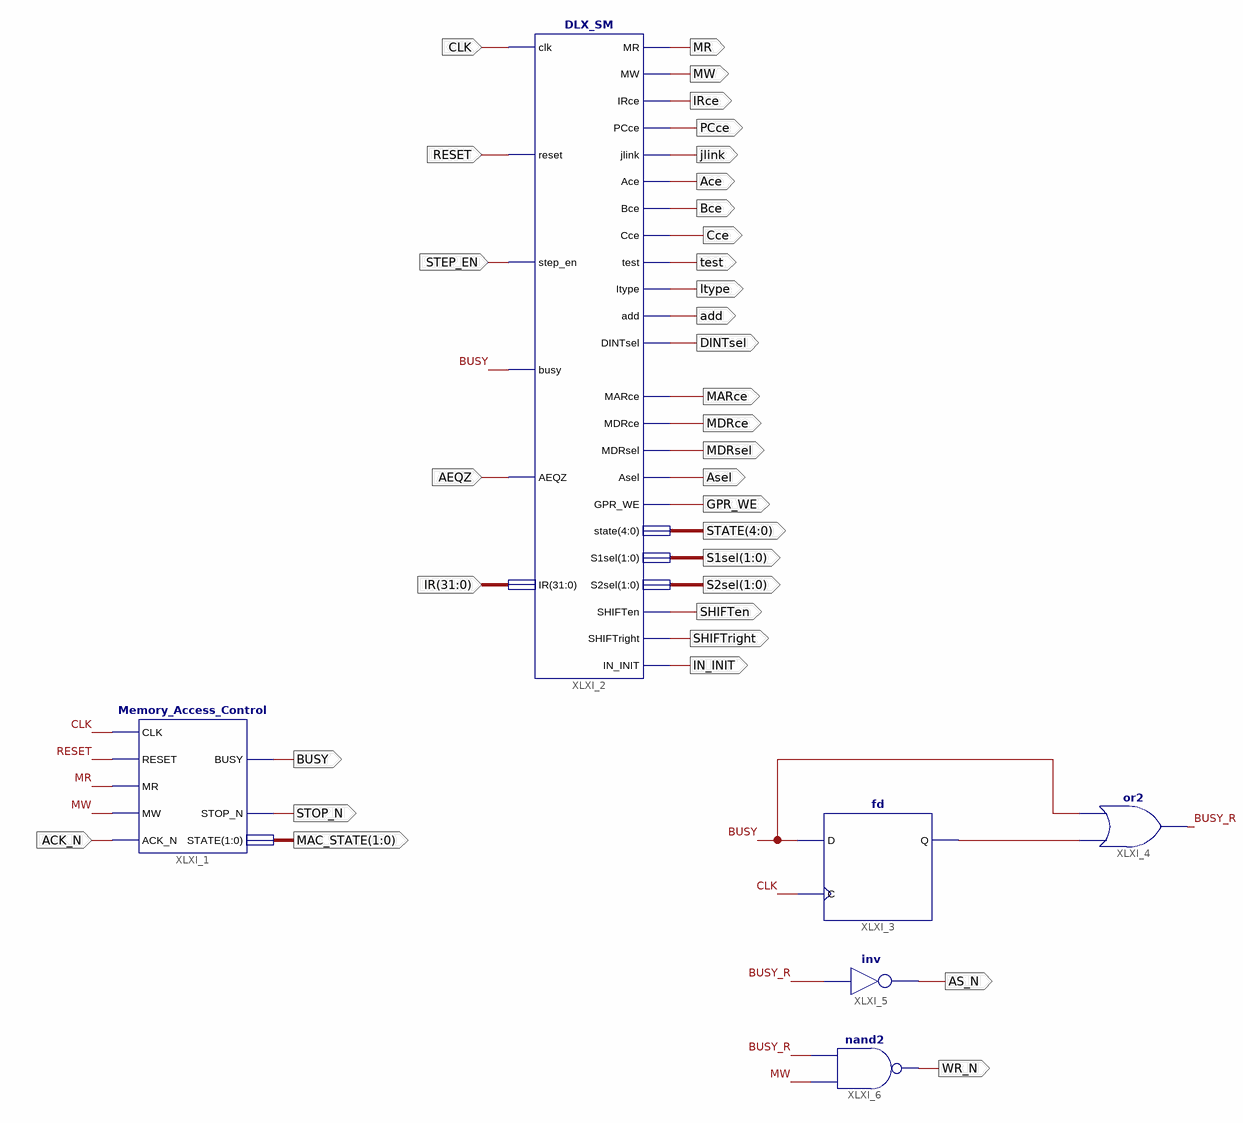
[diagram p0: schematic sheet 1]
// Xilinx ISE schematic DLX_Control.sch (spartan6) as structural Verilog: 6 symbols, 34 ports
module DLX_Control (
  input  ACK_N,
  input  CLK,
  input  RESET,
  input  STEP_EN,
  input  AEQZ,
  input  [31:0] IR,
  output STOP_N,
  output [1:0] MAC_STATE,
  output BUSY,
  output MR,
  output MW,
  output IRce,
  output PCce,
  output jlink,
  output Ace,
  output Bce,
  output Cce,
  output test,
  output Itype,
  output add,
  output DINTsel,
  output MARce,
  output MDRce,
  output MDRsel,
  output Asel,
  output GPR_WE,
  output [4:0] STATE,
  output [1:0] S1sel,
  output [1:0] S2sel,
  output SHIFTen,
  output SHIFTright,
  output AS_N,
  output WR_N,
  output IN_INIT
);

  wire BUSY_R, XLXN_41;

  Memory_Access_Control XLXI_1 (
    .CLK(CLK), .RESET(RESET), .MR(MR), .MW(MW), .ACK_N(ACK_N), .BUSY(BUSY), .STOP_N(STOP_N), .STATE(MAC_STATE));
  DLX_SM XLXI_2 (
    .clk(CLK), .reset(RESET), .step_en(STEP_EN), .busy(BUSY), .AEQZ(AEQZ), .IR(IR), .MR(MR), .MW(MW),
    .IRce(IRce), .PCce(PCce), .jlink(jlink), .Ace(Ace), .Bce(Bce), .Cce(Cce), .test(test), .Itype(Itype),
    .add(add), .DINTsel(DINTsel), .SHIFTen(SHIFTen), .MARce(MARce), .MDRce(MDRce), .MDRsel(MDRsel),
    .Asel(Asel), .GPR_WE(GPR_WE), .SHIFTright(SHIFTright), .state(STATE), .S1sel(S1sel), .S2sel(S2sel),
    .IN_INIT(IN_INIT));
  fd XLXI_3 (.C(CLK), .D(BUSY), .Q(XLXN_41));
  or XLXI_4 (BUSY_R, XLXN_41, BUSY);
  not XLXI_5 (AS_N, BUSY_R);
  nand XLXI_6 (WR_N, MW, BUSY_R);
endmodule
